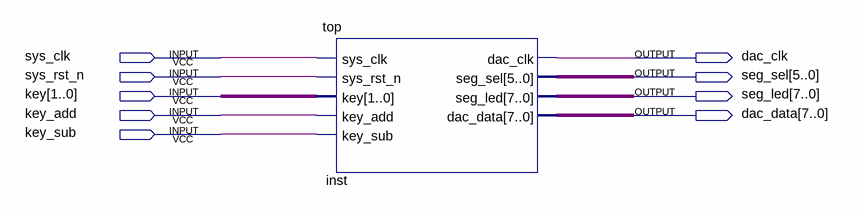
[diagram p0: schematic sheet]
// Quartus schematic test2.bdf as structural Verilog: 1 symbols, 9 pins
module test2 (
  input  sys_clk,
  input  sys_rst_n,
  input  [1:0] key,
  input  key_add,
  input  key_sub,
  output dac_clk,
  output [5:0] seg_sel,
  output [7:0] seg_led,
  output [7:0] dac_data
);

  top inst (
    .sys_clk(sys_clk), .sys_rst_n(sys_rst_n), .key(key), .key_add(key_add), .key_sub(key_sub),
    .dac_clk(dac_clk), .seg_sel(seg_sel), .seg_led(seg_led), .dac_data(dac_data));
endmodule
